# EAGLE design DP_AADKv1a (EAGLE 5.11)
LICENSE: CC-0; PROJECT: Andriod Accessory Development kit
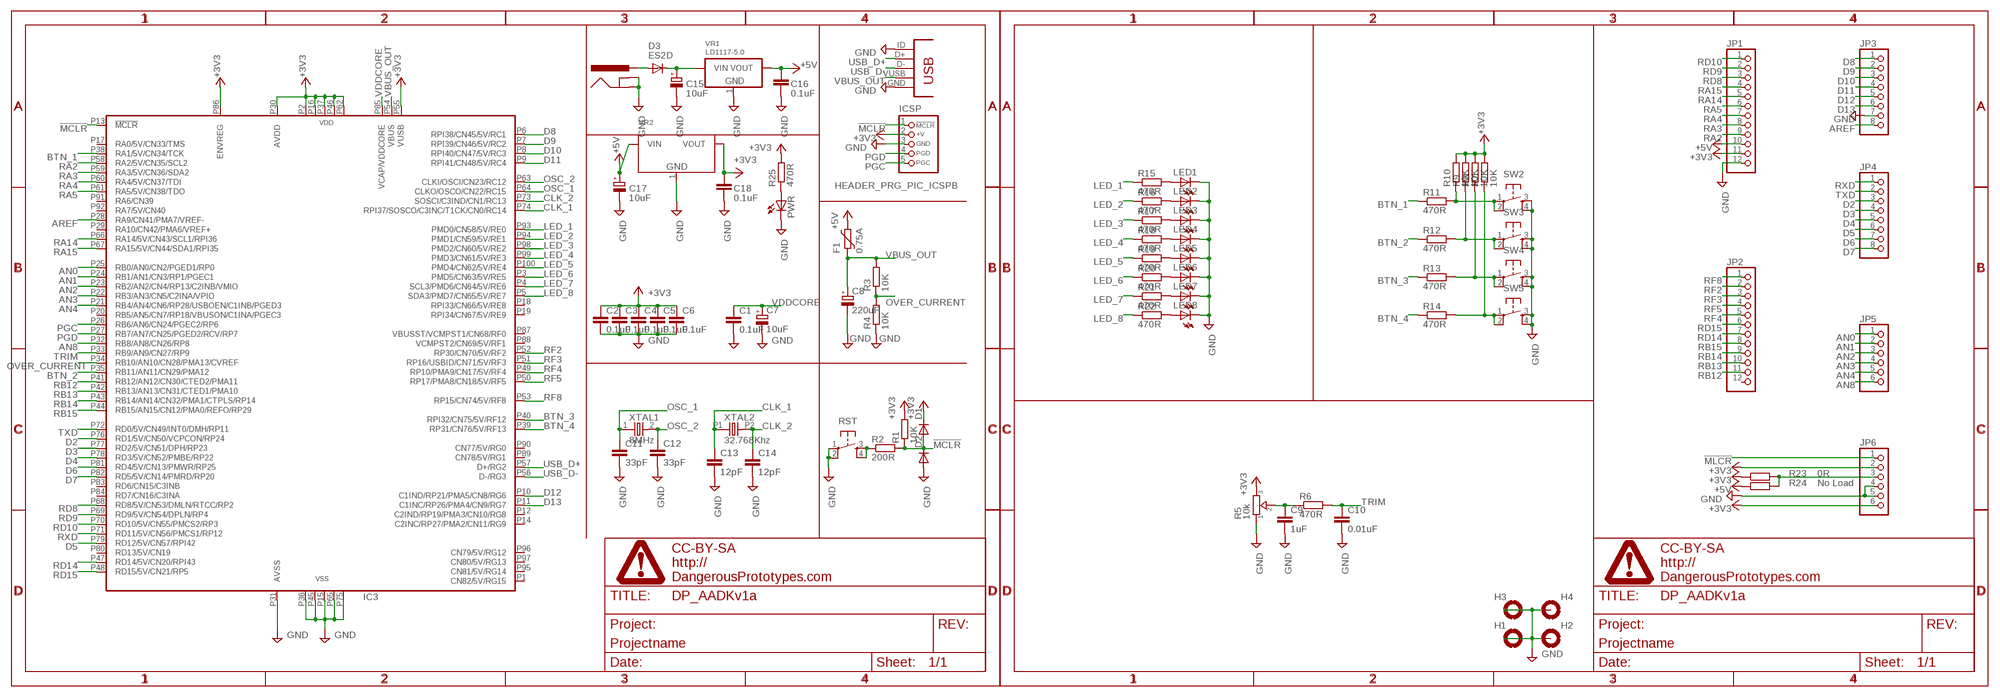
[diagram p0: schematic, sheet 1]

## Parts
C1  0.1uF  CAPC603  [C603]
C2  0.1uF  CAPC603  [C603]
C3  0.1uF  CAPC603  [C603]
C4  0.1uF  CAPC603  [C603]
C5  0.1uF  CAPC603  [C603]
C6  0.1uF  CAPC603  [C603]
C7  10uF  CAP_POLSMC_A  [SMC_A]
C8  220uF  CAP_POLCASE_A  [CASE_A]
C9  1uF  CAPC603  [C603]
C10  0.01uF  CAPC603  [C603]
C11  33pF  CAPC603  [C603]
C12  33pF  CAPC603  [C603]
C13  12pF  CAPC603  [C603]
C14  12pF  CAPC603  [C603]
C15  10uF  CAP_POLSMC_A  [SMC_A]
C16  0.1uF  CAPC603  [C603]
C17  10uF  CAP_POLSMC_A  [SMC_A]
C18  0.1uF  CAPC603  [C603]
D1  DIODEDO323  [DO323]
D2  DIODEDO323  [DO323]
D3  ES2D  [SMB]
F1  0.75A  FUSE_PTC-0805  [0805_PTC]
H1  MOUNT-PAD-ROUND3.3  [3,3-PAD]
H2  MOUNT-PAD-ROUND3.3  [3,3-PAD]
H3  MOUNT-PAD-ROUND3.3  [3,3-PAD]
H4  MOUNT-PAD-ROUND3.3  [3,3-PAD]
IC3  PIC24FJ256GB110-TQFP100  [TQFP100-12MMX12MM]
ICSP  HEADER_PRG_PIC_ICSPB  [HEADER_PRG_1X05_ICSP_B]
JP1  PINHD-1X12_2.54-S  [1X12-S]
JP2  PINHD-1X12_2.54-S  [1X12-S]
JP3  PINHD-1X08_2.54-S  [1X08-S]
JP4  PINHD-1X08_2.54-S  [1X08-S]
JP5  PINHD-1X06_2.54-S  [1X06-S]
JP6  PINHD-1X06_2.54-S  [1X06-S]
LED1  LED805  [LED-805]
LED2  LED805  [LED-805]
LED3  LED805  [LED-805]
LED4  LED805  [LED-805]
LED5  LED805  [LED-805]
LED6  LED805  [LED-805]
LED7  LED805  [LED-805]
LED8  LED805  [LED-805]
PWR  LED805  [LED-805]
R1  10K  RESISTORR603  [R603]
R2  200R  RESISTORR603  [R603]
R3  10K  RESISTORR603  [R603]
R4  10K  RESISTORR603  [R603]
R5  10k  TRIMMER-3362P  [TRIMMER_3362P]
R6  470R  RESISTORR603  [R603]
R7  10K  RESISTORR603  [R603]
R8  10K  RESISTORR603  [R603]
R9  10K  RESISTORR603  [R603]
R10  10K  RESISTORR603  [R603]
R11  470R  RESISTORR603  [R603]
R12  470R  RESISTORR603  [R603]
R13  470R  RESISTORR603  [R603]
R14  470R  RESISTORR603  [R603]
R15  470R  RESISTORR603  [R603]
R16  470R  RESISTORR603  [R603]
R17  470R  RESISTORR603  [R603]
R18  470R  RESISTORR603  [R603]
R19  470R  RESISTORR603  [R603]
R20  470R  RESISTORR603  [R603]
R21  470R  RESISTORR603  [R603]
R22  470R  RESISTORR603  [R603]
R23  0R  RESISTORR603  [R603]
R24  No Load  RESISTORR603  [R603]
R25  470R  RESISTORR603  [R603]
RST  SW-SMD-SMALL  [TACT_SWITCH_SMALL]
SW2  SW-SMD-SMALL  [TACT_SWITCH_SMALL]
SW3  SW-SMD-SMALL  [TACT_SWITCH_SMALL]
SW4  SW-SMD-SMALL  [TACT_SWITCH_SMALL]
SW5  SW-SMD-SMALL  [TACT_SWITCH_SMALL]
U$2  POWER_JACKSMD  [POWER_JACK_SMD]
U$3  DINA4_L  [DP_LOGO]
U$5  DINA4_L  [DP_LOGO]
USB  CON-USB-MINI-BUSB1  [CONN_USB_MINI-B]
VR1  LD1117-5.0  [DPAK]
VR2  LD1117-3.3SOT223  [SOT223]
XTAL1  8MHz  OSC-XTAL  [HC-49U]
XTAL2  32.768Khz  OSC-XTAL-32.768KHZ-TC-26  [TC-26]

## Nets
!MCLR: D1.A D2.C IC3.P13(!MCLR) ICSP.1(/MCLR) R1.1 R2.2
!MLCR: JP6.1
+3V3: C2.1 C3.1 C4.1 C5.1 C6.1 C18.1 D1.C IC3.P2(VDD) IC3.P16(VDD) IC3.P30(AVDD) IC3.P37(VDD) IC3.P46(VDD) IC3.P55(VUSB) IC3.P62(VDD) IC3.P86(ENVREG) ICSP.2(+V) JP1.11 JP6.2 JP6.6 R1.2 R5.3 R7.2 R8.2 R9.2 R10.2 R23.1 R25.2 VR2.2(VOUT)
+5V: C16.1 C17.+ F1.2 JP1.10 R24.1 VR1.2(VOUT) VR2.3(VIN)
AN0: IC3.P25(RB0/AN0/CN2/PGED1/RP0) JP5.1
AN1: IC3.P24(RB1/AN1/CN3/RP1/PGEC1) JP5.2
AN2: IC3.P23(RB2/AN2/CN4/RP13/C2INB/VMIO) JP5.3
AN3: IC3.P22(RB3/AN3/CN5/C2INA/VPIO) JP5.4
AN4: IC3.P21(RB4/AN4/CN6/RP28/USBOEN/C1INB/PGED3) JP5.5
AN8: IC3.P32(RB8/AN8/CN26/RP8) JP5.6
AREF: IC3.P28(RA9/CN41/PMA7/VREF-) JP3.8
BTN_1: IC3.P38(RA1/5V/CN34/TCK) R11.1
BTN_2: IC3.P35(RB11/AN11/CN29/PMA12) R12.1
BTN_3: IC3.P40(RPI32/CN75/5V/RF12) R13.1
BTN_4: IC3.P39(RP31/CN76/5V/RF13) R14.1
CLK_1: C13.1 IC3.P74(RPI37/SOSCO/C3INC/T1CK/CN0/RC14) XTAL2.P1
CLK_2: C14.1 IC3.P73(SOSCI/C3IND/CN1/RC13) XTAL2.P2
D2: IC3.P76(RD1/5V/CN50/VCPCON/RP24) JP4.3
D3: IC3.P77(RD2/5V/CN51/DPH/RP23) JP4.4
D4: IC3.P78(RD3/5V/CN52/PMBE/RP22) JP4.5
D5: IC3.P79(RD12/5V/CN57/RPI42) JP4.6
D6: IC3.P81(RD4/5V/CN13/PMWR/RP25) JP4.7
D7: IC3.P82(RD5/5V/CN14/PMRD/RP20) JP4.8
D8: IC3.P6(RPI38/CN45/5V/RC1) JP3.1
D9: IC3.P7(RPI39/CN46/5V/RC2) JP3.2
D10: IC3.P8(RPI40/CN47/5V/RC3) JP3.3
D11: IC3.P9(RPI41/CN48/5V/RC4) JP3.4
D12: IC3.P10(C1IND/RP21/PMA5/CN8/RG6) JP3.5
D13: IC3.P11(C1INC/RP26/PMA4/CN9/RG7) JP3.6
GND: C1.2 C2.2 C3.2 C4.2 C5.2 C6.2 C7.- C8.- C9.2 C10.2 C11.2 C12.2 C13.2 C14.2 C15.- C16.2 C17.- C18.2 D2.A H1.B3,3(MOUNT) H2.B3,3(MOUNT) H3.B3,3(MOUNT) H4.B3,3(MOUNT) IC3.P15(VSS) IC3.P31(AVSS) IC3.P36(VSS) IC3.P45(VSS) IC3.P65(VSS) IC3.P75(VSS) ICSP.3(GND) JP1.12 JP3.7 JP6.4 JP6.5 LED1.C LED2.C LED3.C LED4.C LED5.C LED6.C LED7.C LED8.C PWR.C R4.1 R5.1 RST.1 RST.2 SW2.3 SW2.4 SW3.3 SW3.4 SW4.3 SW4.4 SW5.3 SW5.4 U$2.GND U$2.P$4(GND) USB.GND USB.ID(USBID) VR1.1(GND) VR2.1(GND)
LED_1: IC3.P93(PMD0/CN58/5V/RE0) R15.1
LED_2: IC3.P94(PMD1/CN59/5V/RE1) R16.1
LED_3: IC3.P98(PMD2/CN60/5V/RE2) R17.1
LED_4: IC3.P99(PMD3/CN61/5V/RE3) R18.1
LED_5: IC3.P100(PMD4/CN62/5V/RE4) R19.1
LED_6: IC3.P3(PMD5/CN63/5V/RE5) R20.1
LED_7: IC3.P4(SCL3/PMD6/CN64/5V/RE6) R21.1
LED_8: IC3.P5(SDA3/PMD7/CN65/5V/RE7) R22.1
N$1: R2.1 RST.3 RST.4
N$2: C9.1 R5.2 R6.1
N$3: R10.1 R11.2 SW2.1 SW2.2
N$4: R9.1 R12.2 SW3.1 SW3.2
N$5: R8.1 R13.2 SW4.1 SW4.2
N$6: R7.1 R14.2 SW5.1 SW5.2
N$7: PWR.A R25.1
N$8: LED1.A R15.2
N$9: LED2.A R16.2
N$10: LED3.A R17.2
N$11: LED4.A R18.2
N$12: LED5.A R19.2
N$13: LED6.A R20.2
N$14: LED7.A R21.2
N$15: LED8.A R22.2
N$16: JP6.3 R23.2 R24.2
N$17: D3.A U$2.VIN0(PWR)
N$18: C15.+ D3.C VR1.3(VIN)
OSC_1: C11.1 IC3.P64(CLKO/OSCO/CN22/RC15) XTAL1.1
OSC_2: C12.1 IC3.P63(CLKI/OSCI/CN23/RC12) XTAL1.2
OVER_CURRENT: IC3.P34(RB10/AN10/CN28/PMA13/CVREF) R3.1 R4.2
PGC: IC3.P26(RB6/AN6/CN24/PGEC2/RP6) ICSP.5(PGC)
PGD: IC3.P27(RB7/AN7/CN25/PGED2/RCV/RP7) ICSP.4(PGD)
RA2: IC3.P58(RA2/5V/CN35/SCL2) JP1.9
RA3: IC3.P59(RA3/5V/CN36/SDA2) JP1.8
RA4: IC3.P60(RA4/5V/CN37/TDI) JP1.7
RA5: IC3.P61(RA5/5V/CN38/TDO) JP1.6
RA14: IC3.P66(RA14/5V/CN43/SCL1/RPI36) JP1.5
RA15: IC3.P67(RA15/5V/CN44/SDA1/RPI35) JP1.4
RB12: IC3.P41(RB12/AN12/CN30/CTED2/PMA11) JP2.11
RB13: IC3.P42(RB13/AN13/CN31/CTED1/PMA10) JP2.10
RB14: IC3.P43(RB14/AN14/CN32/PMA1/CTPLS/RP14) JP2.9
RB15: IC3.P44(RB15/AN15/CN12/PMA0/REFO/RP29) JP2.8
RD8: IC3.P68(RD8/5V/CN53/DMLN/RTCC/RP2) JP1.3
RD9: IC3.P69(RD9/5V/CN54/DPLN/RP4) JP1.2
RD10: IC3.P70(RD10/5V/CN55/PMCS2/RP3) JP1.1
RD14: IC3.P47(RD14/5V/CN20/RPI43) JP2.7
RD15: IC3.P48(RD15/5V/CN21/RP5) JP2.6
RF2: IC3.P52(RP30/CN70/5V/RF2) JP2.2
RF3: IC3.P51(RP16/USBID/CN71/5V/RF3) JP2.3
RF4: IC3.P49(RP10/PMA9/CN17/5V/RF4) JP2.5
RF5: IC3.P50(RP17/PMA8/CN18/5V/RF5) JP2.4
RF8: IC3.P53(RP15/CN74/5V/RF8) JP2.1
RXD: IC3.P71(RD11/5V/CN56/PMCS1/RP12) JP4.1
TRIM: C10.1 IC3.P33(RB9/AN9/CN27/RP9) R6.2
TXD: IC3.P72(RD0/5V/CN49/INT0/DMH/RP11) JP4.2
USB_D+: IC3.P57(D+/RG2) USB.D+
USB_D-: IC3.P56(D-/RG3) USB.D-
VBUS_OUT: C8.+ F1.1 IC3.P54(VBUS) R3.2 USB.VUSB
VDDCORE: C1.1 C7.+ IC3.P85(VCAP/VDDCORE)
Unconnected: IC3.P1(CN82/5V/RG15) IC3.P12(C2IND/RP19/PMA3/CN10/RG8) IC3.P14(C2INC/RP27/PMA2/CN11/RG9) IC3.P17(RA0/5V/CN33/TMS) IC3.P18(RPI33/CN66/5V/RE8) IC3.P19(RPI34/CN67/5V/RE9) IC3.P20(RB5/AN5/CN7/RP18/VBUSON/C1INA/PGEC3) IC3.P29(RA10/CN42/PMA6/VREF+) IC3.P80(RD13/5V/CN19) IC3.P83(RD6/CN15/C3INB) IC3.P84(RD7/CN16/C3INA) IC3.P87(VBUSST/VCMPST1/CN68/RF0) IC3.P88(VCMPST2/CN69/5V/RF1) IC3.P89(CN78/5V/RG1) IC3.P90(CN77/5V/RG0) IC3.P91(RA6/CN39) IC3.P92(RA7/5V/CN40) IC3.P95(CN81/5V/RG14) IC3.P96(CN79/5V/RG12) IC3.P97(CN80/5V/RG13) JP2.12 USB.BODY@1(BODY) USB.BODY@2(BODY) USB.BODY@3(BODY) USB.BODY@4(BODY)

## Library data of the parts
C1-C6 C9-C14 C16 C18 = dp_devices:CAP
C7 C8 C15 C17 = dp_devices:CAP_POL
D1 D2 = dp_devices:DIODE
D3 = diode:ES2D: DIODE super fast rectifier, 2 A
F1 = dp_devices:FUSE_PTC: Resettable PTC
H1-H4 = holes:MOUNT-PAD-ROUND: MOUNTING PAD, round
IC3 = dp_devices:PIC24FJ256GB110: 16-bit Flash Microcontroller with USB OTG
ICSP = dp_devices:HEADER_PRG_PIC_ICSP: 5-pin PIC In Circuit Serial Programming header
JP1 JP2 = pinhead-2:PINHD-1X12: PIN HEADER
JP3 JP4 = pinhead-2:PINHD-1X08: PIN HEADER
JP5 JP6 = pinhead-2:PINHD-1X06: PIN HEADER
LED1-LED8 PWR = dp_devices:LED
R1-R4 R6-R25 = dp_devices:RESISTOR
R5 = dp_devices:TRIMMER: Trimmer resistor
RST SW2-SW5 = dp_devices:SW-SMD-SMALL
U$2 = SparkFun-3-2-07:POWER_JACK: Power Jack This is the standard 5.5mm barrel jack for power. The PTH is the most common, proven, reliable, footprint. All others are experimental. The Slot footprint only works if the mill layer is transmitted to the PCB fab house so be warned. Spark Fun Electronics SKU : PType-BPJ. Mating wall wart : Tools-PS
U$3 U$5 = dp_devices:DINA4_L: A4 DP frame Standard Dangerous Prototypes schematic frame. Automagically adds the DP logo and standard texts to the PCB Use the atrribute in the schematic editor to change the fields.; FF1: fulfillment by; FF2: Seeed Studio; FF3: www.seeedstudio.com; LICENSE: CC-BY-SA; PROJECT: Projectname; URL1: http://; URL2: DangerousPrototypes.com
USB = dp_devices:CON-USB-MINI-B: USB connector
VR1 = dp_devices:LD1117-5.0: Low drop 5.0V positive voltage regulator
VR2 = dp_devices:LD1117-3.3
XTAL1 = dp_devices:OSC-XTAL
XTAL2 = dp_devices:OSC-XTAL-32.768KHZ: 32.768KHz Clock crystal

## Board
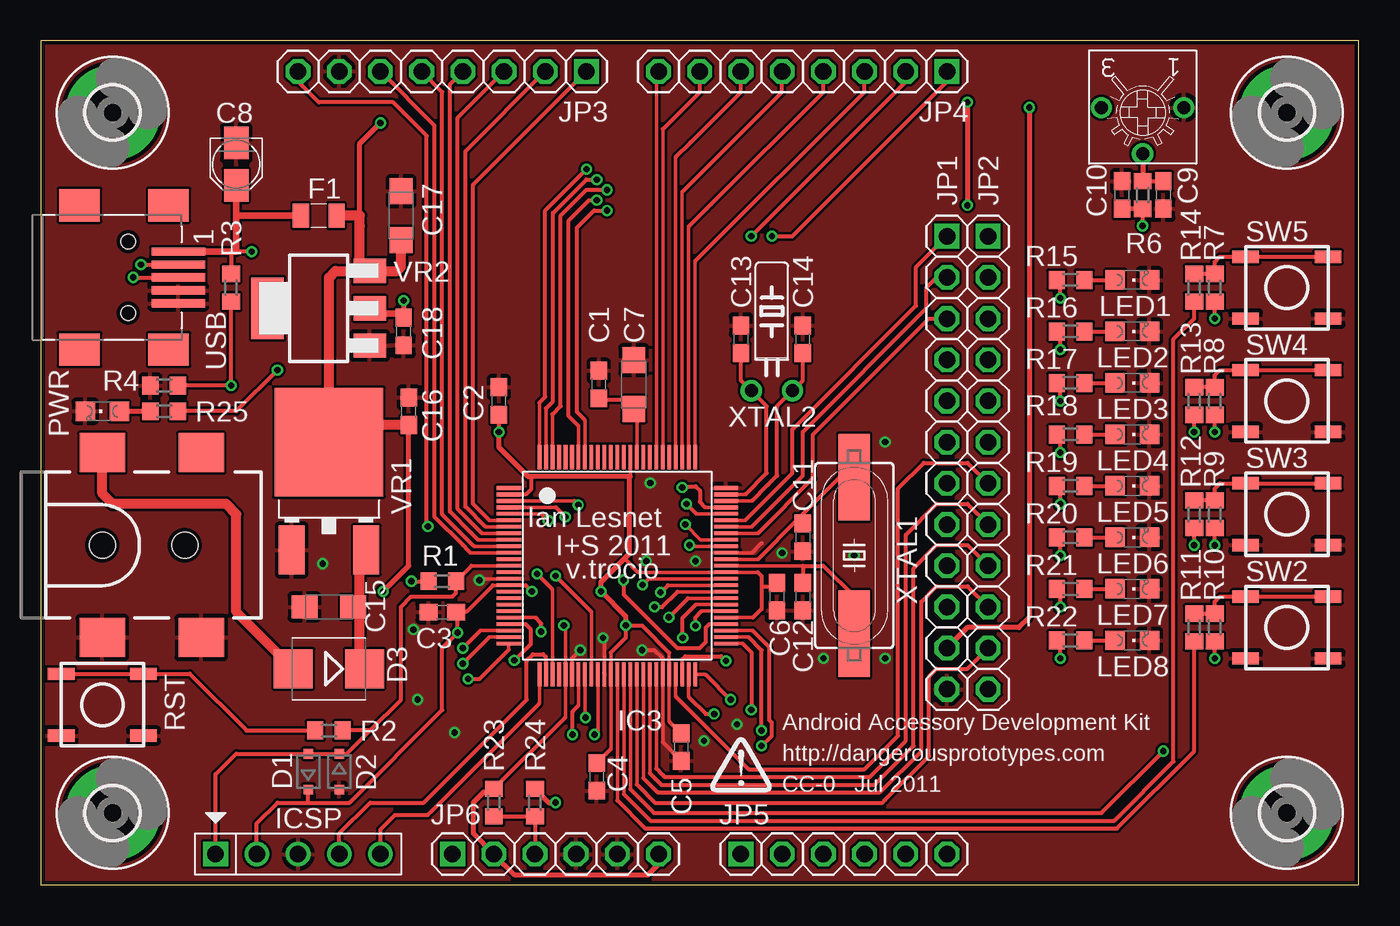
[diagram p1: board, top side]
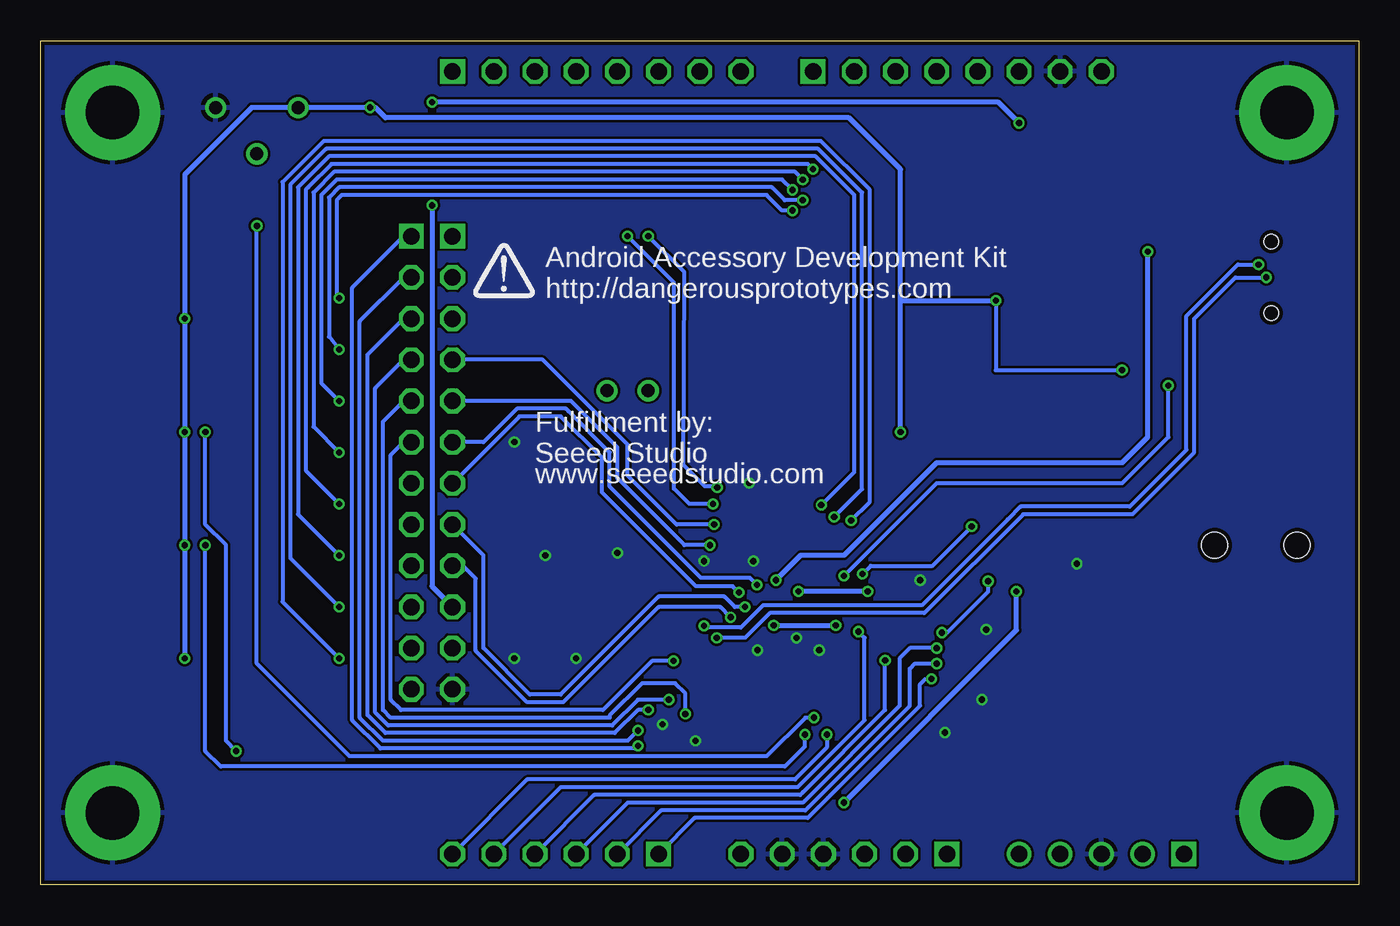
[diagram p2: board, bottom side, seen from below]

Size 81.28 x 52.07 mm. Coordinates in mm from the lower left corner, seen from the top.
Outline: 0,0 81.28,0 81.28,52.07 0,52.06 0,0
Copper layers (1*16): Top 0.035mm / dielectric 1.5mm / Bottom 0.035mm
Design rules "Fusion_eagle_rule_v1.1": minimum track width 6mil, minimum drill 12mil, track to track 6mil, track to pad 6mil, pad to pad 6mil, via to via 6mil, smd to smd 0mil, copper to edge 10mil, drill to drill 10mil, minimum pad ring 10mil, minimum via ring 6mil, stop-mask expansion 2mil, vias tented up to drill 100mil, thermal gap 10mil

### Footprints (pad centres in the part's own frame; a part is rotated, then mirrored left to right if it is on the bottom)
C603 = smd 1.1 x 1: 1 -0.85,0; 2 0.85,0
SMC_A = smd 1.6 x 1.4: + -1.5,0; - 1.5,0
CASE_A = smd 2 x 1.5: + 1.3,0; - -1.3,0
DO323 = smd 0.6 x 0.6: A 1.1,0; C -1.1,0
SMB = smd 2.4 x 2.4: A 2.2,0; C -2.2,0
0805_PTC = smd 1 x 1.5: 1 -1.1,0; 2 1.1,0
3,3-PAD = drill 3.3 pad 5.842 round: B3,3 0,0
TQFP100-12MMX12MM = smd 0.23 x 1.5: P1 -4.8,-6.7; P2 -4.4,-6.7; P3 -4,-6.7; P4 -3.6,-6.7; P5 -3.2,-6.7; P6 -2.8,-6.7; P7 -2.4,-6.7; P8 -2,-6.7; P9 -1.6,-6.7; P10 -1.2,-6.7; P11 -0.8,-6.7; P12 -0.4,-6.7; P13 0,-6.7; P14 0.4,-6.7; P15 0.8,-6.7; P16 1.2,-6.7; P17 1.6,-6.7; P18 2,-6.7; P19 2.4,-6.7; P20 2.8,-6.7; P21 3.2,-6.7; P22 3.6,-6.7; P23 4,-6.7; P24 4.4,-6.7; P25 4.8,-6.7; P51 4.8,6.7; P52 4.4,6.7; P53 4,6.7; P54 3.6,6.7; P55 3.2,6.7; P56 2.8,6.7; P57 2.4,6.7; P58 2,6.7; P59 1.6,6.7; P60 1.2,6.7; P61 0.8,6.7; P62 0.4,6.7; P63 0,6.7; P64 -0.4,6.7; P65 -0.8,6.7; P66 -1.2,6.7; P67 -1.6,6.7; P68 -2,6.7; P69 -2.4,6.7; P70 -2.8,6.7; P71 -3.2,6.7; P72 -3.6,6.7; P73 -4,6.7; P74 -4.4,6.7; P75 -4.8,6.7 | smd 1.5 x 0.23: P26 6.7,-4.8; P27 6.7,-4.4; P28 6.7,-4; P29 6.7,-3.6; P30 6.7,-3.2; P31 6.7,-2.8; P32 6.7,-2.4; P33 6.7,-2; P34 6.7,-1.6; P35 6.7,-1.2; P36 6.7,-0.8; P37 6.7,-0.4; P38 6.7,0; P39 6.7,0.4; P40 6.7,0.8; P41 6.7,1.2; P42 6.7,1.6; P43 6.7,2; P44 6.7,2.4; P45 6.7,2.8; P46 6.7,3.2; P47 6.7,3.6; P48 6.7,4; P49 6.7,4.4; P50 6.7,4.8; P76 -6.7,4.8; P77 -6.7,4.4; P78 -6.7,4; P79 -6.7,3.6; P80 -6.7,3.2; P81 -6.7,2.8; P82 -6.7,2.4; P83 -6.7,2; P84 -6.7,1.6; P85 -6.7,1.2; P86 -6.7,0.8; P87 -6.7,0.4; P88 -6.7,0; P89 -6.7,-0.4; P90 -6.7,-0.8; P91 -6.7,-1.2; P92 -6.7,-1.6; P93 -6.7,-2; P94 -6.7,-2.4; P95 -6.7,-2.8; P96 -6.7,-3.2; P97 -6.7,-3.6; P98 -6.7,-4; P99 -6.7,-4.4; P100 -6.7,-4.8
HEADER_PRG_1X05_ICSP_B = drill 1.016 square: 1 -5.08,0 | drill 1.016 round: 2 -2.54,0; 3 0,0; 4 2.54,0; 5 5.08,0
1X12-S = drill 1.016 square: 1 -13.97,0 | drill 1.016 octagon: 2 -11.43,0; 3 -8.89,0; 4 -6.35,0; 5 -3.81,0; 6 -1.27,0; 7 1.27,0; 8 3.81,0; 9 6.35,0; 10 8.89,0; 11 11.43,0; 12 13.97,0
1X08-S = drill 1.016 square: 1 -8.89,0 | drill 1.016 octagon: 2 -6.35,0; 3 -3.81,0; 4 -1.27,0; 5 1.27,0; 6 3.81,0; 7 6.35,0; 8 8.89,0
1X06-S = drill 1.016 square: 1 -6.35,0 | drill 1.016 octagon: 2 -3.81,0; 3 -1.27,0; 4 1.27,0; 5 3.81,0; 6 6.35,0
LED-805 = smd 1.2 x 1.2: A 0,-1.05; C 0,1.05
R603 = smd 1 x 1.1: 1 -0.85,0; 2 0.85,0
TRIMMER_3362P = drill 0.8 round: 1 -2.54,-0.31; 2 0,2.54; 3 2.54,-0.31
TACT_SWITCH_SMALL = smd 1.651 x 0.762: 1 -2.54,1.905; 2 2.54,1.905; 3 -2.54,-1.905; 4 2.54,-1.905
POWER_JACK_SMD = smd 2.8 x 2.4: GND 0,-5.7; P$4 6.1,-5.7; VIN0 0,5.7; VIN1 6.1,5.7 | hole 1.6: 0,0; 5.08,0
CONN_USB_MINI-B = smd 2 x 2.5: BODY@1 -4.45,2.5; BODY@2 4.45,2.5; BODY@3 4.45,-3; BODY@4 -4.45,-3 | smd 0.5 x 3.3: D+ 0,3.1; D- -0.8,3.1; GND 1.6,3.1; ID 0.8,3.1; VUSB -1.6,3.1 | hole 0.9: -2.2,0; 2.2,0
DPAK = smd 1.6 x 3: 1 -2.3,-6.65; 3 2.3,-6.65 | smd 6.7 x 6.7: 2 0,0
SOT223 = smd 1.5 x 2: 1 -2.3,-3.15; 2 0,-3.15; 3 2.3,-3.15 | smd 3.8 x 2: 4 0,3.15
HC-49U = smd 5.334 x 1.93: 1 -4.826,0; 2 4.826,0
TC-26 = drill 0.8 round: P1 -1.27,-2.54; P2 1.27,-2.54

### Placement (x,y rotation side)
C1  34.42,30.86 90 top
C2  28.26,29.84 90 top
C3  24.77,16.83 180 top
C4  34.29,6.67 270 top
C5  39.5,8.51 270 top
C6  45.4,17.78 270 top
C7  36.58,30.86 90 top
C8  12.06,44.45 270 top
C9  69.22,42.55 270 top
C10  66.67,42.55 90 top
C11  46.99,21.43 270 top
C12  46.99,17.78 270 top
C13  43.18,33.66 90 top
C14  46.99,33.66 90 top
C15  17.78,17.14 180 top
C16  22.7,29.21 90 top
C17  22.23,41.27 90 top
C18  22.38,34.13 270 top
D1  16.51,6.99 90 top
D2  18.41,6.99 270 top
D3  17.78,13.34 180 top
F1  17.14,41.27 0 top
H1  76.83,4.45 0 top
H2  4.45,47.62 0 top
H3  4.45,4.45 0 top
H4  76.83,47.62 0 top
IC3  35.56,19.68 270 top
ICSP  15.88,1.91 0 top
JP1  55.88,26.04 270 top
JP2  58.42,26.04 270 top
JP3  24.77,50.16 180 top
JP4  46.99,50.16 180 top
JP5  49.53,1.91 0 top
JP6  31.75,1.91 0 top
LED1  67.31,37.31 270 top
LED2  67.31,34.13 270 top
LED3  67.31,30.96 270 top
LED4  67.31,27.78 270 top
LED5  67.31,24.61 270 top
LED6  67.31,21.43 270 top
LED7  67.31,18.26 270 top
LED8  67.31,15.08 270 top
PWR  3.81,29.21 90 top
R1  24.77,18.73 180 top
R2  17.78,9.53 0 top
R3  11.75,36.83 90 top
R4  7.62,30.8 0 top
R5  67.94,47.62 180 top
R6  67.94,42.55 270 top
R7  72.39,36.83 270 top
R8  72.39,29.84 270 top
R9  72.39,22.86 270 top
R10  72.39,15.88 270 top
R11  71.12,15.88 90 top
R12  71.12,22.86 90 top
R13  71.12,29.84 90 top
R14  71.12,36.83 90 top
R15  63.5,37.31 0 top
R16  63.5,34.13 0 top
R17  63.5,30.96 0 top
R18  63.5,27.78 0 top
R19  63.5,24.61 0 top
R20  63.5,21.43 0 top
R21  63.5,18.26 0 top
R22  63.5,15.08 0 top
R23  27.94,5.08 270 top
R24  30.48,5.08 270 top
R25  7.62,29.21 0 top
RST  3.81,11.11 180 top
SW2  76.83,15.88 0 top
SW3  76.83,22.86 0 top
SW4  76.83,29.84 0 top
SW5  76.83,36.83 0 top
U$1  [DP-LOGO_TOP]  41.27,5.71 0 top
U$2  3.81,20.95 0 top
U$3  1.91,-6.35 0 top  (outside the outline)
U$4  [DP-LOGO-BOTTOM]  50.8,36.2 0 top
U$5  1.91,-6.35 0 top  (outside the outline)
USB  5.4,37.47 270 top
VR1  17.78,27.3 0 top
VR2  17.14,35.56 90 top
XTAL1  50.16,20.32 270 top
XTAL2  45.09,33.02 0 top

### Tracks (layer width: path | path; a pad name or v marks a point on that pad's centre or on a via)
!MCLR
  Top 0.229: 26.57,19.68 IC3.P13
  Top 0.254: 26.57,19.68 R1.1 25.61,18 25.4,17.78 22.86,17.78 22.23,17.14 22.23,11.43 20.32,9.53 | ICSP.1 10.79,6.83 12.06,8.1 16.5,8.1 D1.A D2.C 18.88,8.09 20.32,9.53 | 20.32,9.53 R2.2
+3V3  (via drill 0.38)
  Top 0.229: 32.36,15.85 IC3.P30 32.36,10.35 | 29.9,18.48 IC3.P16 27.88,18.48 | 29.93,24.09 IC3.P2 | 44.22,19.29 IC3.P62 36.85,19.29 | 43.92,16.48 IC3.P55 | 35.16,8.39 IC3.P37 35.16,14.33 | 38.76,10.1 IC3.P46 38.76,14.33 | IC3.P86 36.36,25.2 36.34,25.18
  Top 0.254: C18.1 22.49,35.08 22.38,35.08 v22.38,36.04 | ICSP.2 13.34,3.81 14.61,5.08 16.51,5.08 | v72.39,13.97 R10.2 | v72.39,20.95 R9.2 | v72.39,27.94 R8.2 | v72.39,34.92 R7.2 | 44.45,18.41 44.45,19.05 44.22,19.29 | C6.1 45.3,18.63 45.09,18.41 44.45,18.41 | v28.26,27.94 C2.1 | v22.86,18.73 R1.2 | R25.2 12.06,29.21 v14.61,31.75 | 16.51,5.08 19.05,5.08 24.77,10.79 24.77,14.61 v25.72,15.56 25.72,16.73 C3.1 25.61,16.88 26.28,16.88 27.88,18.48 | 16.51,5.08 D1.C | v32.26,16 32.36,15.85 | 29.9,18.48 v30.29,18.1 | 29.93,24.09 30.23,24.38 30.23,25.18 | 36.01,20.13 36.85,19.29 | 43.92,16.48 44.45,17.02 44.45,18.41 | 32.36,10.35 R23.1 | 35.16,8.39 C4.1 | 38.76,10.1 C5.1 | 38.76,14.33 37.08,16 v36.08,16 36.08,15.25 35.16,14.33
  Top 0.305: R23.1 27.94,5.71 27.3,5.71 26.67,5.08 26.67,3.17 JP6.2 29.21,0.64 37.47,0.64 38.1,1.27 JP6.6 | v22.38,36.04 C18.1 | v28.26,27.94 28.26,26.99 30.06,25.18 30.23,25.18 36.34,25.18 36.31,25.15 36.31,20.43 36.01,20.13 34.55,18.68 v34.55,18.1 36.08,16.57 v36.08,16 | JP1.11 57.15,15.88 60.33,15.88 60.96,16.51 v60.96,47.94
  Top 0.406: VR2.2 20.3,35.27 20.32,35.24 22.38,35.24 22.38,35.08 22.28,35.08 C18.1
  Bottom 0.254: v22.86,18.73 22.86,18.1 25.4,15.56 v25.72,15.56 | v14.61,31.75 22.38,31.75 v22.38,36.04
  Bottom 0.305: v72.39,13.97 v72.39,20.95 v72.39,27.94 v72.39,34.92 72.39,43.81 68.27,47.94 R5.3 60.63,47.94 | v36.08,16 v32.26,16 | v30.29,18.1 v34.55,18.1 | 28.26,36.04 v22.38,36.04 | v28.26,27.94 28.26,36.04 | 28.26,36.04 28.26,44.13 31.43,47.31 60.01,47.31 60.63,47.94 | 60.63,47.94 v60.96,47.94
+5V  (via drill 0.38)
  Top 0.305: v20.95,46.99 19.68,45.72 19.68,40.64 | v57.15,48.26 v57.15,41.91 | C16.1 22.7,19.68 v21.11,18.1 | v31.75,5.08 31.33,5.08 R24.1
  Top 0.61: C16.1 17.57,28.36 17.46,28.26 17.46,27.94 17.36,27.73 VR1.2 17.78,37.47 18.18,37.86 VR2.3 | VR2.3 19.93,37.86 19.68,38.1 19.68,40.64 19.68,41.27 F1.2 | VR2.3 21.98,37.86 22.23,38.1 C17.+
  Bottom 0.305: JP1.10 57.15,18.41 v57.15,41.91 | v20.95,46.99 22.23,48.26 v57.15,48.26 | v21.11,18.1 21.11,15.72 v31.75,5.08
AN0  (via drill 0.38)
  Top 0.229: 28.86,14.51 IC3.P25
  Top 0.254: 28.86,14.51 27.05,12.7 v26.35,12.7
  Bottom 0.254: v26.35,12.7 26.73,12.7 27.05,12.38 27.05,11.05 33.97,4.13 40.96,4.13 JP5.1
AN1  (via drill 0.38)
  Top 0.229: 27.67,15.29 IC3.P24
  Top 0.254: v26.04,13.65 27.67,15.29
  Bottom 0.254: v26.04,13.65 27.37,13.65 27.69,13.34 27.69,11.05 33.66,5.08 | 33.66,5.08 | 33.66,5.08 34.13,4.6 43.02,4.6 JP5.2
AN2  (via drill 0.38)
  Top 0.229: 27.11,15.69 IC3.P23
  Top 0.254: v26.04,14.61 27.11,15.69
  Bottom 0.254: v26.04,14.61 27.69,14.61 28.32,13.97 28.32,11.05 34.29,5.08 45.09,5.08 JP5.3
AN3  (via drill 0.38)
  Top 0.229: 29.89,16.09 IC3.P22
  Top 0.254: 29.89,16.09 30.23,15.75 30.23,14.86 v29.21,13.84
  Bottom 0.254: v29.21,13.84 29.21,10.79 34.29,5.71 | 34.29,5.71 | 34.29,5.71 34.45,5.56 47.15,5.56 JP5.4
AN4  (via drill 0.38)
  Top 0.229: 30.5,16.48 IC3.P21
  Top 0.254: 30.5,16.48 30.86,16.13 v30.86,15.62
  Bottom 0.254: JP5.5 49.21,6.03 34.61,6.03 30.48,10.16 30.48,15.24 v30.86,15.62
AN8  (via drill 0.38)
  Top 0.229: 33.16,11.06 IC3.P32
  Top 0.254: v32.8,9.27 32.8,10.7 33.16,11.06
  Bottom 0.254: JP5.6 51.28,6.51 34.77,6.51 32.8,8.48 v32.8,9.27
AREF  (via drill 0.38)
  Top 0.229: IC3.P28 31.56,18.22
  Top 0.254: JP3.8 15.88,49.53 17.14,48.26 21.75,48.26 23.81,46.2 23.81,22.16 v23.88,22.1 | 31.56,18.22 v30.61,19.18
  Bottom 0.254: v30.61,19.18 30.1,19.68 26.29,19.68 v23.88,22.1
BTN_1
  Top 0.229: 35.56,5.21 IC3.P38
  Top 0.254: R11.1 71.12,8.26 66.36,3.49 37.27,3.49 35.56,5.21
BTN_2  (via drill 0.38)
  Top 0.229: 34.36,9.47 IC3.P35
  Top 0.254: v71.12,20.95 R12.1 | v34.16,9.27 34.36,9.47
  Bottom 0.254: v34.16,9.27 34.16,8.54 35.4,7.3 70.17,7.3 71.12,8.26 v71.12,20.95
BTN_3  (via drill 0.38)
  Top 0.229: 36.36,5.9 IC3.P40
  Top 0.254: v71.12,27.94 R13.1 | v69.22,8.26 65.41,4.45 37.81,4.45 36.36,5.9
  Bottom 0.254: v71.12,27.94 71.12,22.23 69.85,20.95 69.85,8.89 v69.22,8.26
BTN_4
  Top 0.229: 35.96,5.6 IC3.P39
  Top 0.254: R14.1 71.12,34.92 69.85,33.66 69.85,7.62 66.2,3.97 37.59,3.97 35.96,5.6
CLK_1
  Top 0.229: IC3.P74 43.45,24.09
  Top 0.254: C13.1 43.18,31.11 XTAL2.P1 44.77,29.53 44.77,25.4 43.45,24.09
CLK_2
  Top 0.229: IC3.P73 43.85,23.68
  Top 0.254: C14.1 46.99,31.11 XTAL2.P2 45.4,29.53 45.4,25.24 44.85,24.68 43.85,23.68
D2
  Top 0.229: IC3.P76 40.36,38.45
  Top 0.254: JP4.3 50.8,48.9 40.36,38.45
D3
  Top 0.229: IC3.P77 39.96,40.59
  Top 0.254: JP4.4 48.26,48.9 41.34,41.97 41.06,41.7 39.96,40.59
D4
  Top 0.229: IC3.P78 39.56,42.73
  Top 0.254: JP4.5 45.72,48.9 39.56,42.73
D5
  Top 0.229: IC3.P79 39.16,44.88
  Top 0.254: JP4.6 43.18,48.9 40.2,45.91 40.06,45.77 39.16,44.88
D6
  Top 0.229: IC3.P81 38.36,46.62
  Top 0.254: JP4.7 40.64,48.9 38.36,46.62
D7
  Top 0.229: IC3.P82 37.96,50.02
  Top 0.254: 37.96,50.02 JP4.8
D8
  Top 0.229: 27.68,22.48 IC3.P6
  Top 0.254: JP3.1 26.67,43.18 26.67,23.5 27.68,22.48
D9
  Top 0.229: 27.45,22.09 IC3.P7
  Top 0.254: JP3.2 26.19,45.24 26.19,23.34 27.45,22.09
D10
  Top 0.229: 27.21,21.68 IC3.P8
  Top 0.254: JP3.3 25.72,47.31 25.72,23.18 27.21,21.68
D11
  Top 0.229: 26.98,21.29 IC3.P9
  Top 0.254: 26.57,21.68 25.24,23.02 25.24,49.37 JP3.4 | 26.57,21.68 | 26.57,21.68 26.98,21.29
D12
  Top 0.229: 26.74,20.89 IC3.P10
  Top 0.254: JP3.5 24.77,48.9 24.77,22.86 26.74,20.89
D13
  Top 0.229: 26.5,20.48 IC3.P11
  Top 0.254: JP3.6 24.29,46.83 24.29,22.7 26.04,20.95 26.3,20.68 26.5,20.48
GND  (via drill 0.38)
  Top 0.229: 27.14,18.89 IC3.P15 | 38.36,8.8 IC3.P45 38.36,13.96 | IC3.P31 32.76,13.96 | IC3.P36 34.76,15.15 | IC3.P65 43.85,20.48
  Top 0.254: v27.05,18.8 27.14,18.89 | C5.2 38.36,8.8 | 38.36,13.96 37.85,14.48 v37.08,14.48 | 32.76,13.96 v33.27,14.48 | 34.76,15.15 v34.67,15.24 | 43.85,20.48 44.45,21.08
  other vias: 45.72,20.48 50.16,20.32 48.26,13.97 52.07,13.97 52.07,27.3 40.89,8.89 42.93,9.91 40.39,19.97 37.34,19.97 37.59,24.8 22.99,15.75 17.4,19.81 23.24,11.43 25.53,9.4
  pour Bottom: 0,52.07 81.28,52.07 81.28,-0.64 0,-0.64
  pour Top: 0,52.07 81.28,52.07 81.28,-0.64 0,-0.64
LED_1  (via drill 0.38)
  Top 0.229: IC3.P93 33.56,28.67
  Top 0.254: v62.87,36.2 62.87,37.31 62.76,37.2 R15.1 | v34.92,41.59 34.13,41.59 33.06,40.52 33.06,29.17 33.56,28.67
  Bottom 0.254: v62.87,36.2 63.02,36.35 63.02,42.23 62.71,42.55 36.51,42.55 35.56,41.59 v34.92,41.59
LED_2  (via drill 0.38)
  Top 0.229: IC3.P94 33.16,28.31
  Top 0.254: R16.1 62.55,33.87 62.76,34.03 62.87,34.13 v62.87,33.02 | v34.29,42.23 33.81,42.23 32.56,40.97 32.56,28.91 33.16,28.31
  Bottom 0.254: v62.87,33.02 63.5,33.81 63.5,42.39 62.87,43.02 36.2,43.02 35.4,42.23 v34.29,42.23
LED_3  (via drill 0.38)
  Top 0.229: IC3.P98 31.56,29.02
  Top 0.254: R17.1 62.55,30.85 62.76,30.85 62.87,30.96 v62.87,29.84 | v34.92,42.86 33.66,42.86 32.07,41.27 32.07,29.53 31.56,29.02
  Bottom 0.254: v34.92,42.86 35.56,43.5 63.02,43.5 63.98,42.55 63.98,30.96 v62.87,29.84
LED_4  (via drill 0.38)
  Top 0.229: IC3.P99 31.16,29.38
  Top 0.254: R18.1 62.55,27.68 62.76,27.68 62.87,27.78 v62.87,26.67 | v34.29,43.5 33.66,43.5 31.59,41.43 31.59,29.81 31.16,29.38
  Bottom 0.254: v34.29,43.5 34.77,43.97 63.18,43.97 64.45,42.7 64.45,28.26 v62.87,26.67
LED_5  (via drill 0.38)
  Top 0.229: IC3.P100 30.76,29.74
  Top 0.254: R19.1 62.55,24.5 62.76,24.5 62.87,24.61 v62.87,23.5 | v33.66,44.13 31.11,41.59 31.11,30.1 30.76,29.74
  Bottom 0.254: 64.77,43.02 63.34,44.45 33.97,44.45 v33.66,44.13 | 64.77,43.02 | 64.77,43.02 64.93,42.86 64.93,25.56 v62.87,23.5
LED_6  (via drill 0.38)
  Top 0.229: IC3.P3 32.89,23.68
  Top 0.254: R20.1 62.55,21.33 62.76,21.33 62.87,21.43 v62.87,20.32 | 32.89,23.68 v33.15,23.43
  Bottom 0.254: 65.25,43.18 63.5,44.93 33.5,44.93 31.11,42.55 31.11,25.46 v33.15,23.43 | 65.25,43.18 | 65.25,43.18 65.41,43.02 65.41,22.86 v62.87,20.32
LED_7  (via drill 0.38)
  Top 0.229: IC3.P4 31.77,23.29
  Top 0.254: R21.1 62.55,18.15 62.76,18.15 62.87,18.26 v62.87,17.14 | 31.77,23.29 v32.35,22.7
  Bottom 0.254: v62.87,17.14 65.88,20.16 65.88,43.18 63.66,45.4 33.34,45.4 30.64,42.7 30.64,24.42 v32.35,22.7
LED_8  (via drill 0.38)
  Top 0.229: IC3.P5 30.9,22.89
  Top 0.254: R22.1 62.55,14.98 62.76,14.98 62.87,15.08 v62.87,13.97 | 30.9,22.89 v31.3,22.48
  Bottom 0.254: 66.2,43.5 63.82,45.88 33.18,45.88 30.16,42.86 30.16,23.62 v31.3,22.48 | 66.2,43.5 | 66.2,43.5 66.36,43.34 66.36,17.46 v62.87,13.97
N$1
  Top 0.254: RST.4 RST.3 9.21,13.02 12.7,9.53 R2.1
N$2
  Top 0.254: R6.1 C9.1
  Top 0.305: R5.2 R6.1
N$3
  Top 0.254: SW2.2 SW2.1 72.71,17.78 72.39,17.46 R10.1 R11.2
N$4
  Top 0.254: SW3.2 SW3.1 72.71,24.77 72.39,24.45 R9.1 R12.2
N$5
  Top 0.254: SW4.2 SW4.1 72.71,31.75 72.39,31.43 R8.1 R13.2
N$6
  Top 0.254: SW5.2 SW5.1 72.71,38.73 72.39,38.42 R7.1 R14.2
N$7
  Top 0.305: PWR.A R25.1
N$8
  Top 0.254: R15.2 LED1.A
N$9
  Top 0.254: R16.2 LED2.A
N$10
  Top 0.254: R17.2 LED3.A
N$11
  Top 0.254: R18.2 LED4.A
N$12
  Top 0.254: R19.2 LED5.A
N$13
  Top 0.254: R20.2 LED6.A
N$14
  Top 0.254: R21.2 LED7.A
N$15
  Top 0.254: R22.2 LED8.A
N$16
  Top 0.254: JP6.3 R24.2 R23.2
N$17
  Top 0.61: U$2.VIN0 3.81,24.13 4.45,23.5 11.43,23.5 12.06,22.86 12.06,16.85 D3.A
N$18
  Top 0.61: D3.C 19.98,13.68 19.68,13.97 19.68,16.74 C15.+ 19.68,17.55 19.68,20.32 20.02,20.66 VR1.3
OSC_1
  Top 0.229: IC3.P64 44.22,20.09
  Top 0.254: 46.67,22.54 49.85,25.72 50.16,26.04 | C11.1 46.77,22.44 46.67,22.54 | 44.22,20.09 46.67,22.54
  Top 0.406: XTAL1.1 49.85,25.15 49.85,25.72
OSC_2
  Top 0.229: IC3.P63 46.99,19.68
  Top 0.254: XTAL1.2 50.16,17.78 48.26,19.68 46.99,19.68 C12.1
OVER_CURRENT  (via drill 0.38)
  Top 0.229: 33.96,16.84 IC3.P34
  Top 0.254: R4.2 v11.75,30.8 R3.1 | v31.75,19.05 33.96,16.84
  Bottom 0.254: v11.75,30.8 11.75,27.62 14.61,24.77 26.04,24.77 v31.75,19.05
PGC
  Top 0.229: 30.76,11.2 IC3.P26
  Top 0.254: 30.76,11.2 24.13,4.57 23.88,4.32 21.84,4.32 20.95,3.43 ICSP.5
PGD
  Top 0.229: 31.16,14.05 IC3.P27
  Top 0.254: 31.16,14.05 30.99,14.22 30.35,14.22 29.97,13.84 29.97,11.43 23.62,5.08 20.32,5.08 18.41,3.17 ICSP.4
RA2  (via drill 0.38)
  Top 0.229: 39.91,17.68 IC3.P58
  Top 0.254: v38.73,16.51 39.91,17.68
  Bottom 0.254: JP1.9 55.24,19.68 54.45,18.89 54.45,14.45 51.28,11.27 49.05,11.27 43.18,17.14 39.37,17.14 v38.73,16.51
RA3  (via drill 0.38)
  Top 0.229: 39.26,18.09 IC3.P59
  Top 0.254: v37.85,17.14 38.32,17.14 39.26,18.09
  Bottom 0.254: JP1.8 53.98,20.32 53.98,14.61 51.12,11.75 49.21,11.75 43.18,17.78 39.12,17.78 38.48,17.14 v37.85,17.14
RA4  (via drill 0.38)
  Top 0.229: 38.68,18.48 IC3.P60
  Top 0.254: v38.23,18.03 38.68,18.48
  Bottom 0.254: JP1.7 51.75,28.89 49.21,28.89 46.67,26.35 46.67,24.22 40.87,18.41 38.61,18.41 v38.23,18.03
RA5  (via drill 0.38)
  Top 0.229: 37.49,18.89 IC3.P61
  Top 0.254: v37.12,18.51 37.49,18.89
  Bottom 0.254: 48.74,29.21 46.2,26.67 46.2,24.56 40.58,18.94 37.54,18.94 v37.12,18.51 | 48.74,29.21 | 48.74,29.21 48.9,29.37 51.91,29.37 53.98,27.3 JP1.6
RA14  (via drill 0.38)
  Top 0.229: IC3.P66 40.08,20.89 v40.01,20.95
  Bottom 0.254: v40.01,20.95 41.59,20.95 45.72,25.08 45.72,26.99 48.58,29.84 JP1.5
RA15  (via drill 0.38)
  Top 0.229: IC3.P67 40.69,21.29 v39.75,22.23
  Bottom 0.254: v39.75,22.23 42.07,22.23 45.09,25.24 45.09,27.15 50.32,32.38 JP1.4
RB12
  Top 0.229: 36.76,6.2 IC3.P41
  Top 0.254: 52.07,5.24 54.77,7.94 54.77,12.86 55.24,13.34 57.15,13.34 JP2.11 | 52.07,5.24 | 52.07,5.24 51.91,5.08 37.88,5.08 36.76,6.2
RB13
  Top 0.229: 37.16,6.59 IC3.P42
  Top 0.254: JP2.10 57.15,18.41 55.24,18.41 54.29,17.46 54.29,8.26 51.75,5.71 38.04,5.71 37.16,6.59
RB14
  Top 0.229: 37.56,6.89 IC3.P43
  Top 0.254: 51.59,6.35 53.82,8.57 53.82,19.53 55.24,20.95 57.15,20.95 JP2.9 | 51.59,6.35 | 51.59,6.35 51.44,6.19 38.26,6.19 38.16,6.29 37.91,6.54 37.56,6.89
RB15
  Top 0.229: 37.96,7.19 IC3.P44
  Top 0.254: JP2.8 57.15,23.5 55.24,23.5 53.34,21.59 53.34,8.89 51.12,6.67 38.48,6.67 38.13,7.02 38.39,6.76 37.96,7.19
RD8
  Top 0.229: IC3.P68 44.23,21.68
  Top 0.254: JP1.3 54.77,34.92 47.62,27.78 47.62,25.08 44.23,21.68
RD9
  Top 0.229: IC3.P69 43.83,22.09
  Top 0.254: JP1.2 55.24,37.47 54.61,36.83 54.61,35.56 46.99,27.94 46.99,25.24 43.83,22.09
RD10
  Top 0.229: IC3.P70 43.44,22.48
  Top 0.254: JP1.1 53.98,38.1 53.98,35.72 46.35,28.1 46.35,25.4 43.44,22.48
RD14
  Top 0.229: 39.16,11.64 IC3.P47
  Top 0.254: JP2.7 57.15,26.04 54.45,26.04 52.86,24.45 52.86,9.21 50.8,7.14 43.66,7.14 39.16,11.64
RD15  (via drill 0.38)
  Top 0.229: IC3.P48 39.56,13.91
  Top 0.254: 39.56,13.91 39.75,14.1 41.97,14.1 v42.26,13.81
  Bottom 0.254: JP2.6 58.9,27.3 59.69,26.51 59.69,11.43 59.05,10.79 46.61,10.79 43.59,13.81 v42.26,13.81
RF2  (via drill 0.38)
  Top 0.229: 43.64,15.29 IC3.P52
  Top 0.254: v44.45,9.53 44.45,14.48 43.64,15.29
  Bottom 0.254: JP2.2 58.9,37.47 61.59,34.77 61.59,10.32 60.17,8.89 45.09,8.89 v44.45,9.53
RF3  (via drill 0.38)
  Top 0.229: IC3.P51 43.28,14.88
  Top 0.254: v43.81,10.79 43.81,14.35 43.28,14.88
  Bottom 0.254: JP2.3 58.9,34.92 61.12,32.7 61.12,10.48 60.01,9.37 45.88,9.37 44.45,10.79 v43.81,10.79
RF4  (via drill 0.38)
  Top 0.229: 39.96,11.6 IC3.P49
  Top 0.254: 39.96,11.6 41.02,10.54 v41.53,10.54
  Bottom 0.254: JP2.5 58.9,29.84 60.17,28.57 60.17,10.79 59.69,10.32 46.2,10.32 46.2,10.45 44.2,12.45 42.16,12.45 41.53,11.81 v41.53,10.54
RF5  (via drill 0.38)
  Top 0.229: IC3.P50 40.99,12.98
  Top 0.254: 40.99,12.98 v42.55,11.43
  Bottom 0.254: JP2.4 58.9,32.38 60.64,30.64 60.64,10.64 59.85,9.84 46.04,9.84 44.45,11.43 v42.55,11.43
RF8  (via drill 0.38)
  Top 0.229: 43.88,15.69 IC3.P53
  Top 0.254: v44.45,8.57 45.09,9.21 45.09,10 44.93,10.16 44.93,14.64 43.88,15.69
  Bottom 0.254: JP2.1 58.9,40.01 62.07,36.83 62.07,10.16 60.33,8.41 44.61,8.41 v44.45,8.57
RXD  (via drill 0.38)
  Top 0.229: 40.42,22.89 IC3.P71
  Top 0.254: JP4.1 55.88,49.53 46.35,40.01 v45.09,40.01 | v39.81,23.5 40.42,22.89
  Bottom 0.254: v45.09,40.01 42.23,37.15 42.23,24.45 41.27,23.5 v39.81,23.5
TRIM  (via drill 0.38)
  Top 0.229: 33.56,10.35 IC3.P33
  Top 0.254: R6.2 C10.1 67.73,41.7 67.94,41.91 v67.94,40.64 | v33.59,10.32 33.56,10.35
  Bottom 0.254: v67.94,40.64 67.94,13.65 62.23,7.94 36.51,7.94 34.13,10.32 v33.59,10.32
TXD  (via drill 0.38)
  Top 0.229: 40.98,23.29 IC3.P72
  Top 0.254: v43.81,40.01 53.34,49.53 JP4.2 | 40.98,23.29 40.64,23.62 40.64,24.32 40.39,24.57 39.62,24.57 v39.56,24.51
  Bottom 0.254: v43.81,40.01 41.59,37.78 41.66,25.91 40.32,24.57 39.62,24.57 v39.56,24.51
USB_D+  (via drill 0.38)
  Top 0.229: 40.4,17.29 IC3.P57
  Top 0.254: v5.71,37.47 USB.D+ | v39.59,15.24 39.59,16.48 40.4,17.29
  Bottom 0.254: v5.71,37.47 7.62,37.47 10.16,34.92 10.16,26.67 13.97,22.86 20.7,22.86 26.8,16.76 36.32,16.76 37.85,15.24 v39.59,15.24
USB_D-  (via drill 0.38)
  Top 0.229: 40.76,16.89 IC3.P56
  Top 0.254: USB.D- v6.18,38.27 v6.19,38.26 | 40.76,16.89 40.39,16.51 v40.39,15.97
  Bottom 0.254: v6.19,38.26 7.46,38.26 10.64,35.08 10.64,26.83 13.97,23.5 | 13.97,23.5 | 13.97,23.5 14.13,23.34 20.86,23.34 21.65,22.54 | 21.65,22.54 | 21.65,22.54 26.96,17.24 36.73,17.24 38.1,15.88 40.48,15.88 v40.39,15.97
VBUS_OUT  (via drill 0.38)
  Top 0.229: 41.23,16.09 IC3.P54
  Top 0.254: 11.75,39.05 11.75,39.06 | 11.75,39.05 R3.2 | v13.02,39.05 11.75,39.05 | 41.23,16.09 41.02,15.88 41.02,14.99 40.64,14.61 39.24,14.61 35.94,17.91 35.94,18.67
  Top 0.305: v35.94,18.8 35.94,18.67
  Top 0.406: 12.06,41.27 C8.+ | USB.VUSB 11.75,39.06 12.06,39.06 12.06,41.27 | 12.06,41.27 F1.1
  Bottom 0.305: v13.02,39.05 13.02,27.62 14.61,26.04 26.04,26.04 31.75,20.32 34.42,20.32 v35.94,18.8
VDDCORE
  Top 0.229: IC3.P85 36.76,29.29
  Top 0.254: C7.+ 36.55,29.13 | C7.+ 36.32,29.91 34.52,29.91 C1.1 | 36.76,29.29 C7.+

### Text on the board
tPlace: Ian Lesnet | I+S 2011 | v.trocio | Android Accessory Development Kit | http://dangerousprototypes.com | CC-0 | Jul 2011
bNames: Android Accessory Development Kit | http://dangerousprototypes.com | Fulfillment by: | Seeed Studio | www.seeedstudio.com